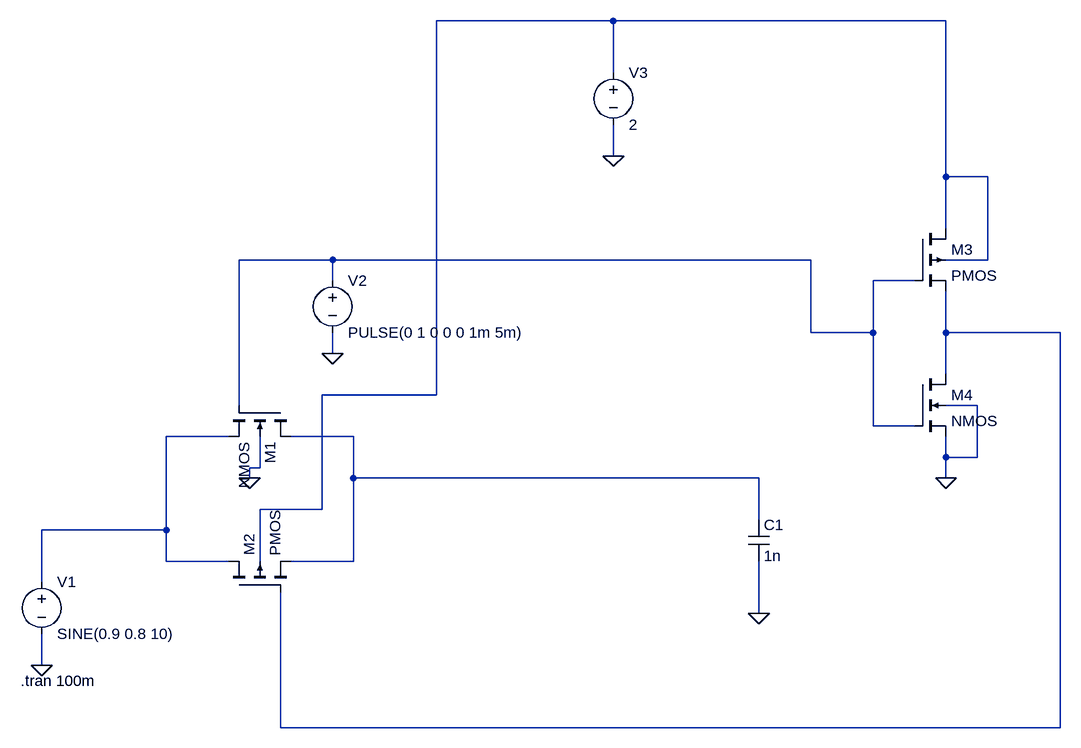
[diagram p0: schematic sampler.asc]
sampler.asc, the LTspice schematic file:
Version 4
SHEET 1 1784 680
WIRE 880 -704 608 -704
WIRE 1392 -704 880 -704
WIRE 880 -624 880 -704
WIRE 880 -496 880 -544
WIRE 1392 -464 1392 -704
WIRE 1456 -464 1392 -464
WIRE 1392 -384 1392 -464
WIRE 448 -336 304 -336
WIRE 1184 -336 448 -336
WIRE 1456 -336 1456 -464
WIRE 1456 -336 1392 -336
WIRE 448 -304 448 -336
WIRE 1344 -304 1280 -304
WIRE 1184 -224 1184 -336
WIRE 1280 -224 1280 -304
WIRE 1280 -224 1184 -224
WIRE 1392 -224 1392 -288
WIRE 1568 -224 1392 -224
WIRE 448 -192 448 -224
WIRE 1392 -160 1392 -224
WIRE 608 -128 608 -704
WIRE 608 -128 432 -128
WIRE 304 -112 304 -336
WIRE 1440 -112 1392 -112
WIRE 1280 -80 1280 -224
WIRE 1344 -80 1280 -80
WIRE 288 -64 192 -64
WIRE 480 -64 384 -64
WIRE 1392 -32 1392 -64
WIRE 1440 -32 1440 -112
WIRE 1440 -32 1392 -32
WIRE 336 -16 336 -64
WIRE 336 -16 320 -16
WIRE 320 0 320 -16
WIRE 480 0 480 -64
WIRE 1104 0 480 0
WIRE 1392 0 1392 -32
WIRE 432 48 432 -128
WIRE 432 48 336 48
WIRE 1104 64 1104 0
WIRE 192 80 192 -64
WIRE 192 80 0 80
WIRE 192 128 192 80
WIRE 288 128 192 128
WIRE 336 128 336 48
WIRE 480 128 480 0
WIRE 480 128 384 128
WIRE 0 160 0 80
WIRE 1104 208 1104 128
WIRE 0 288 0 240
WIRE 368 384 368 176
WIRE 1568 384 1568 -224
WIRE 1568 384 368 384
FLAG 0 288 0
FLAG 448 -192 0
FLAG 880 -496 0
FLAG 1104 208 0
FLAG 320 0 0
FLAG 1392 0 0
SYMBOL voltage 0 144 R0
WINDOW 123 24 124 Left 2
WINDOW 39 0 0 Left 2
SYMATTR InstName V1
SYMATTR Value SINE(0.9 0.8 10)
SYMBOL voltage 448 -320 R0
WINDOW 123 0 0 Left 2
WINDOW 39 0 0 Left 2
SYMATTR InstName V2
SYMATTR Value PULSE(0 1 0 0 0 1m 5m)
SYMBOL voltage 880 -640 R0
WINDOW 123 0 0 Left 2
WINDOW 39 0 0 Left 2
SYMATTR InstName V3
SYMATTR Value 2
SYMBOL cap 1088 64 R0
SYMATTR InstName C1
SYMATTR Value 1n
SYMBOL nmos4 384 -112 R90
SYMATTR InstName M1
SYMATTR Value2 l=2u w=20u
SYMBOL pmos4 288 176 R270
SYMATTR InstName M2
SYMATTR Value2 l=2u w=20u
SYMBOL pmos4 1344 -384 R0
SYMATTR InstName M3
SYMATTR Value2 l=2u w=10u
SYMBOL nmos4 1344 -160 R0
SYMATTR InstName M4
SYMATTR Value2 l=2u w=10u
TEXT -32 312 Left 2 !.tran 100m

The netlist it stands for:
* sampler.asc
V1 N004 0 SINE(0.9 0.8 10)
V2 N002 0 PULSE(0 1 0 0 0 1m 5m)
V3 N001 0 2
C1 N005 0 1n
M1 N005 N002 N004 0 NMOS l=2u w=20u
M2 N004 N003 N005 N001 PMOS l=2u w=20u
M3 N001 N002 N003 N001 PMOS l=2u w=10u
M4 N003 N002 0 0 NMOS l=2u w=10u
.model NMOS NMOS
.model PMOS PMOS
.lib standard.mos
.tran 100m
.backanno
.end